# EAGLE design 2022国技館コントローラ (EAGLE 9.6.2)
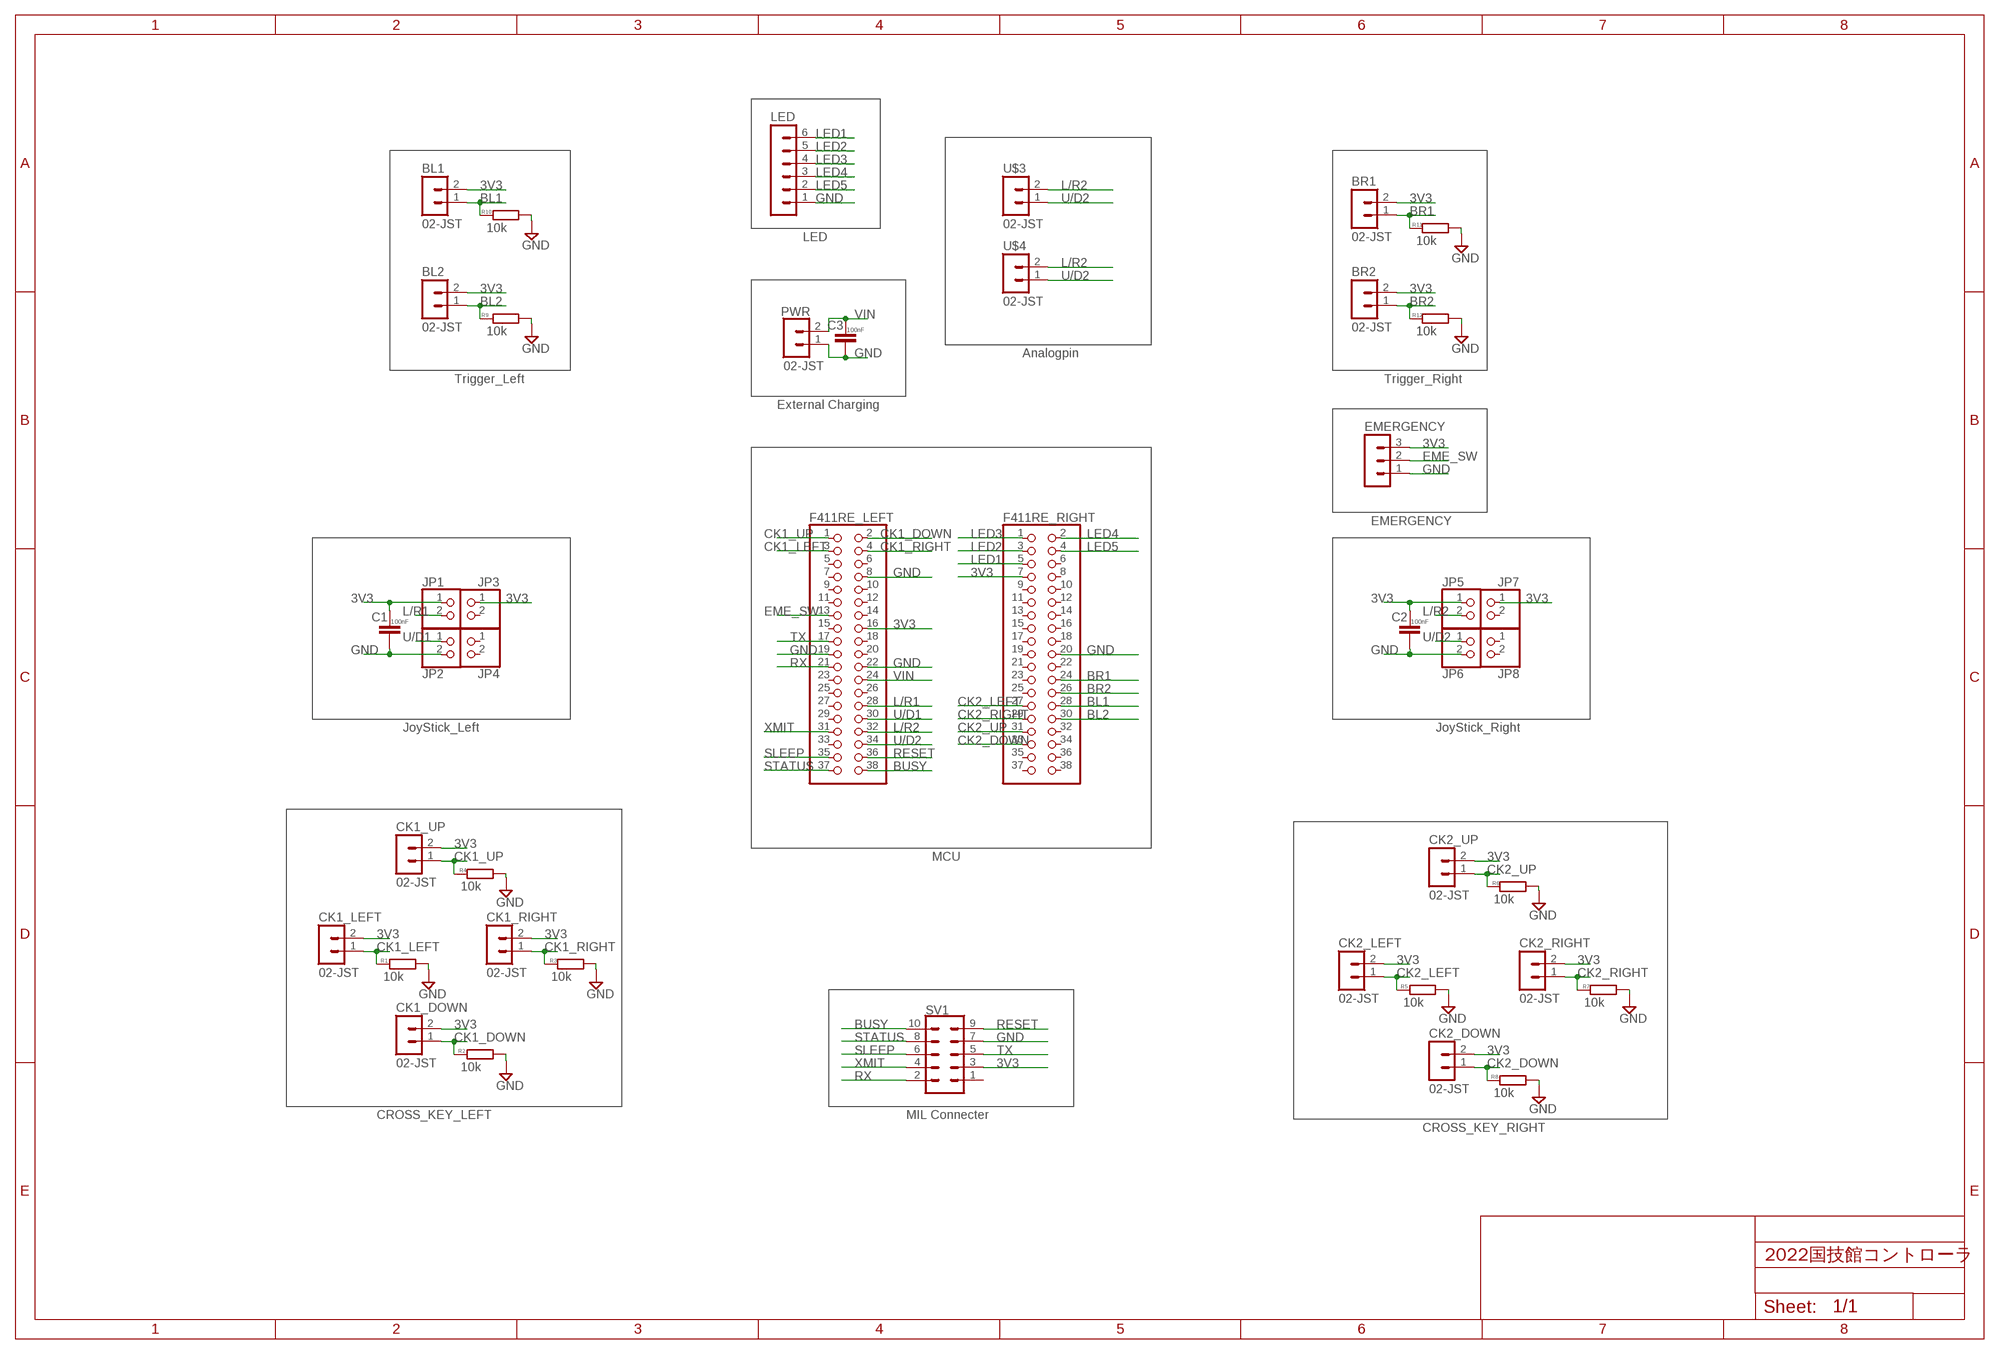
[diagram p0: schematic, sheet 1]

## Parts
BL1  02-JST  [B2B-XH]
BL2  02-JST  [B2B-XH]
BR1  02-JST  [B2B-XH]
BR2  02-JST  [B2B-XH]
C1  100nF  C-EU025-024X044  [C025-024X044]
C2  100nF  C-EU025-024X044  [C025-024X044]
C3  100nF  C-EU025-024X044  [C025-024X044]
CK1_DOWN  02-JST  [B2B-XH]
CK1_LEFT  02-JST  [B2B-XH]
CK1_RIGHT  02-JST  [B2B-XH]
CK1_UP  02-JST  [B2B-XH]
CK2_DOWN  02-JST  [B2B-XH]
CK2_LEFT  02-JST  [B2B-XH]
CK2_RIGHT  02-JST  [B2B-XH]
CK2_UP  02-JST  [B2B-XH]
EMERGENCY  03-JST  [B3B-XH]
F411RE_LEFT  PINHD-2X19  [2X19]
F411RE_RIGHT  PINHD-2X19  [2X19]
JP1  PINHD-1X2  [1X02]
JP2  PINHD-1X2  [1X02]
JP3  PINHD-1X2  [1X02]
JP4  PINHD-1X2  [1X02]
JP5  PINHD-1X2  [1X02]
JP6  PINHD-1X2  [1X02]
JP7  PINHD-1X2  [1X02]
JP8  PINHD-1X2  [1X02]
LED  06-JST  [B6B-XH]
PWR  02-JST  [B2B-XH]
R1  10k  R-EU_0204/7  [0204/7]
R2  10k  R-EU_0204/7  [0204/7]
R3  10k  R-EU_0204/7  [0204/7]
R4  10k  R-EU_0204/7  [0204/7]
R5  10k  R-EU_0204/7  [0204/7]
R6  10k  R-EU_0204/7  [0204/7]
R7  10k  R-EU_0204/7  [0204/7]
R8  10k  R-EU_0204/7  [0204/7]
R9  10k  R-EU_0204/7  [0204/7]
R10  10k  R-EU_0204/7  [0204/7]
R11  10k  R-EU_0204/7  [0204/7]
R12  10k  R-EU_0204/7  [0204/7]
SV1  ML10  [ML10]
U$3  02-JST  [B2B-XH]
U$4  02-JST  [B2B-XH]

## Nets
3V3: BL1.2 BL2.2 BR1.2 BR2.2 C1.1 C2.1 CK1_DOWN.2 CK1_LEFT.2 CK1_RIGHT.2 CK1_UP.2 CK2_DOWN.2 CK2_LEFT.2 CK2_RIGHT.2 CK2_UP.2 EMERGENCY.3 F411RE_LEFT.16 F411RE_RIGHT.7 JP1.1 JP3.1 JP5.1 JP7.1 SV1.3
BL1: BL1.1 F411RE_RIGHT.28 R10.1
BL2: BL2.1 F411RE_RIGHT.30 R9.1
BR1: BR1.1 F411RE_RIGHT.24 R11.1
BR2: BR2.1 F411RE_RIGHT.26 R12.1
BUSY: F411RE_LEFT.38 SV1.10
CK1_DOWN: CK1_DOWN.1 F411RE_LEFT.2 R2.1
CK1_LEFT: CK1_LEFT.1 F411RE_LEFT.3 R1.1
CK1_RIGHT: CK1_RIGHT.1 F411RE_LEFT.4 R3.1
CK1_UP: CK1_UP.1 F411RE_LEFT.1 R4.1
CK2_DOWN: CK2_DOWN.1 F411RE_RIGHT.33 R8.1
CK2_LEFT: CK2_LEFT.1 F411RE_RIGHT.27 R5.1
CK2_RIGHT: CK2_RIGHT.1 F411RE_RIGHT.29 R7.1
CK2_UP: CK2_UP.1 F411RE_RIGHT.31 R6.1
EME_SW: EMERGENCY.2 F411RE_LEFT.13
GND: C1.2 C2.2 C3.2 EMERGENCY.1 F411RE_LEFT.8 F411RE_LEFT.19 F411RE_LEFT.22 F411RE_RIGHT.20 JP2.2 JP6.2 LED.1 PWR.1 R1.2 R2.2 R3.2 R4.2 R5.2 R6.2 R7.2 R8.2 R9.2 R10.2 R11.2 R12.2 SV1.7
L/R1: F411RE_LEFT.28 JP1.2
L/R2: F411RE_LEFT.32 JP5.2 U$3.2 U$4.2
LED1: F411RE_RIGHT.5 LED.6
LED2: F411RE_RIGHT.3 LED.5
LED3: F411RE_RIGHT.1 LED.4
LED4: F411RE_RIGHT.2 LED.3
LED5: F411RE_RIGHT.4 LED.2
RESET: F411RE_LEFT.36 SV1.9
RX: F411RE_LEFT.21 SV1.2
SLEEP: F411RE_LEFT.35 SV1.6
STATUS: F411RE_LEFT.37 SV1.8
TX: F411RE_LEFT.17 SV1.5
U/D1: F411RE_LEFT.30 JP2.1
U/D2: F411RE_LEFT.34 JP6.1 U$3.1 U$4.1
VIN: C3.1 F411RE_LEFT.24 PWR.2
XMIT: F411RE_LEFT.31 SV1.4
Unconnected: F411RE_LEFT.5 F411RE_LEFT.6 F411RE_LEFT.7 F411RE_LEFT.9 F411RE_LEFT.10 F411RE_LEFT.11 F411RE_LEFT.12 F411RE_LEFT.14 F411RE_LEFT.15 F411RE_LEFT.18 F411RE_LEFT.20 F411RE_LEFT.23 F411RE_LEFT.25 F411RE_LEFT.26 F411RE_LEFT.27 F411RE_LEFT.29 F411RE_LEFT.33 F411RE_RIGHT.6 F411RE_RIGHT.8 F411RE_RIGHT.9 F411RE_RIGHT.10 F411RE_RIGHT.11 F411RE_RIGHT.12 F411RE_RIGHT.13 F411RE_RIGHT.14 F411RE_RIGHT.15 F411RE_RIGHT.16 F411RE_RIGHT.17 F411RE_RIGHT.18 F411RE_RIGHT.19 F411RE_RIGHT.21 F411RE_RIGHT.22 F411RE_RIGHT.23 F411RE_RIGHT.25 F411RE_RIGHT.32 F411RE_RIGHT.34 F411RE_RIGHT.35 F411RE_RIGHT.36 F411RE_RIGHT.37 F411RE_RIGHT.38 JP3.2 JP4.1 JP4.2 JP7.2 JP8.1 JP8.2 SV1.1

## Notes on the sheet
- LED
- Analogpin
- Trigger_Left | Trigger_Right
- External Charging
- EMERGENCY
- JoyStick_Left | JoyStick_Right
- MCU
- CROSS_KEY_LEFT | MIL Connecter
- CROSS_KEY_RIGHT

## Library data of the parts
BL1 BL2 BR1 BR2 CK1_DOWN CK1_LEFT CK1_RIGHT CK1_UP CK2_DOWN CK2_LEFT CK2_RIGHT CK2_UP = con-jst-xh:02-JST: JST CONNECTOR
C1-C3 = rcl:C-EU: CAPACITOR, European symbol; SPICEPREFIX: C
EMERGENCY = con-jst-xh:03-JST: JST CONNECTOR
F411RE_LEFT F411RE_RIGHT = pinhead:PINHD-2X19: PIN HEADER
JP1-JP8 = pinhead:PINHD-1X2: PIN HEADER
LED = con-jst-xh:06-JST: JST CONNECTOR
PWR U$3 U$4 = con-jst-xh (1):02-JST: JST CONNECTOR
R1-R12 = rcl:R-EU_: RESISTOR, European symbol; SPICEPREFIX: R
SV1 = con-ml:ML10: HARTING; OC_FARNELL: unknown; OC_NEWARK: unknown

## Board
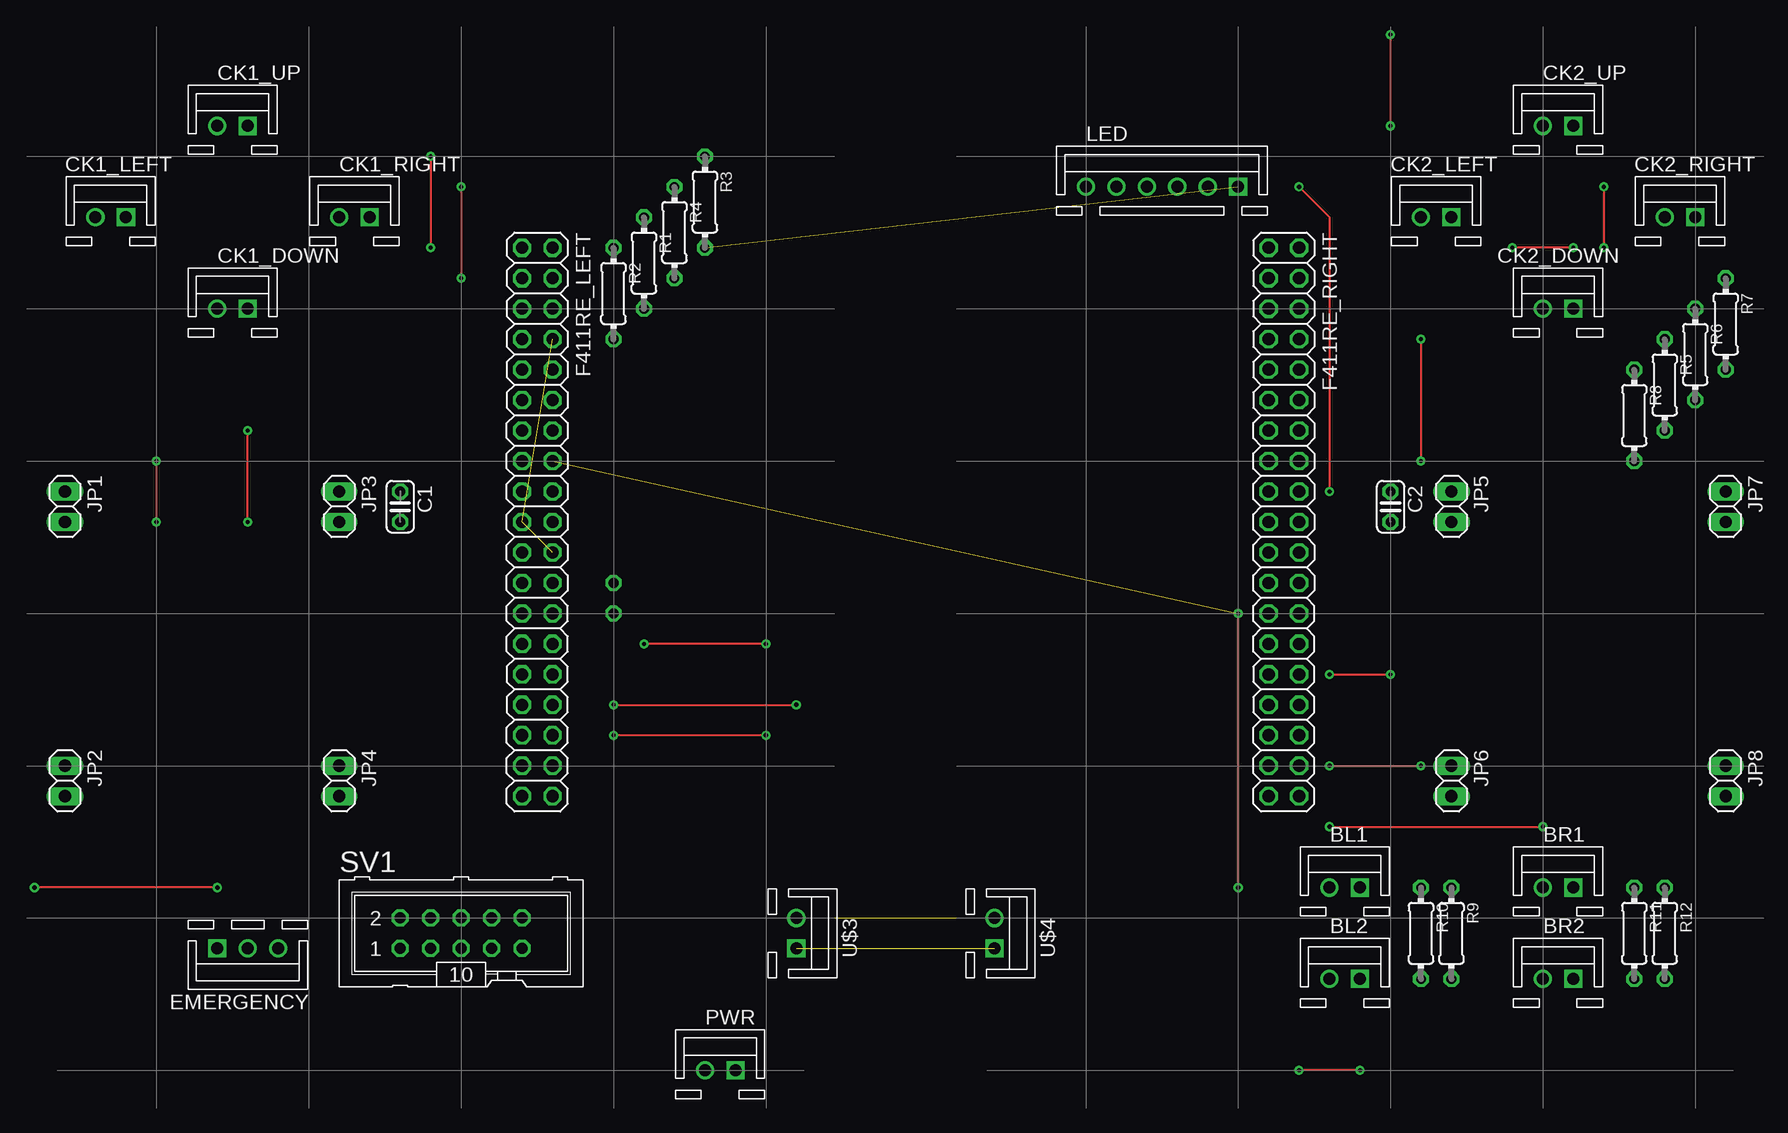
[diagram p1: board, top side]
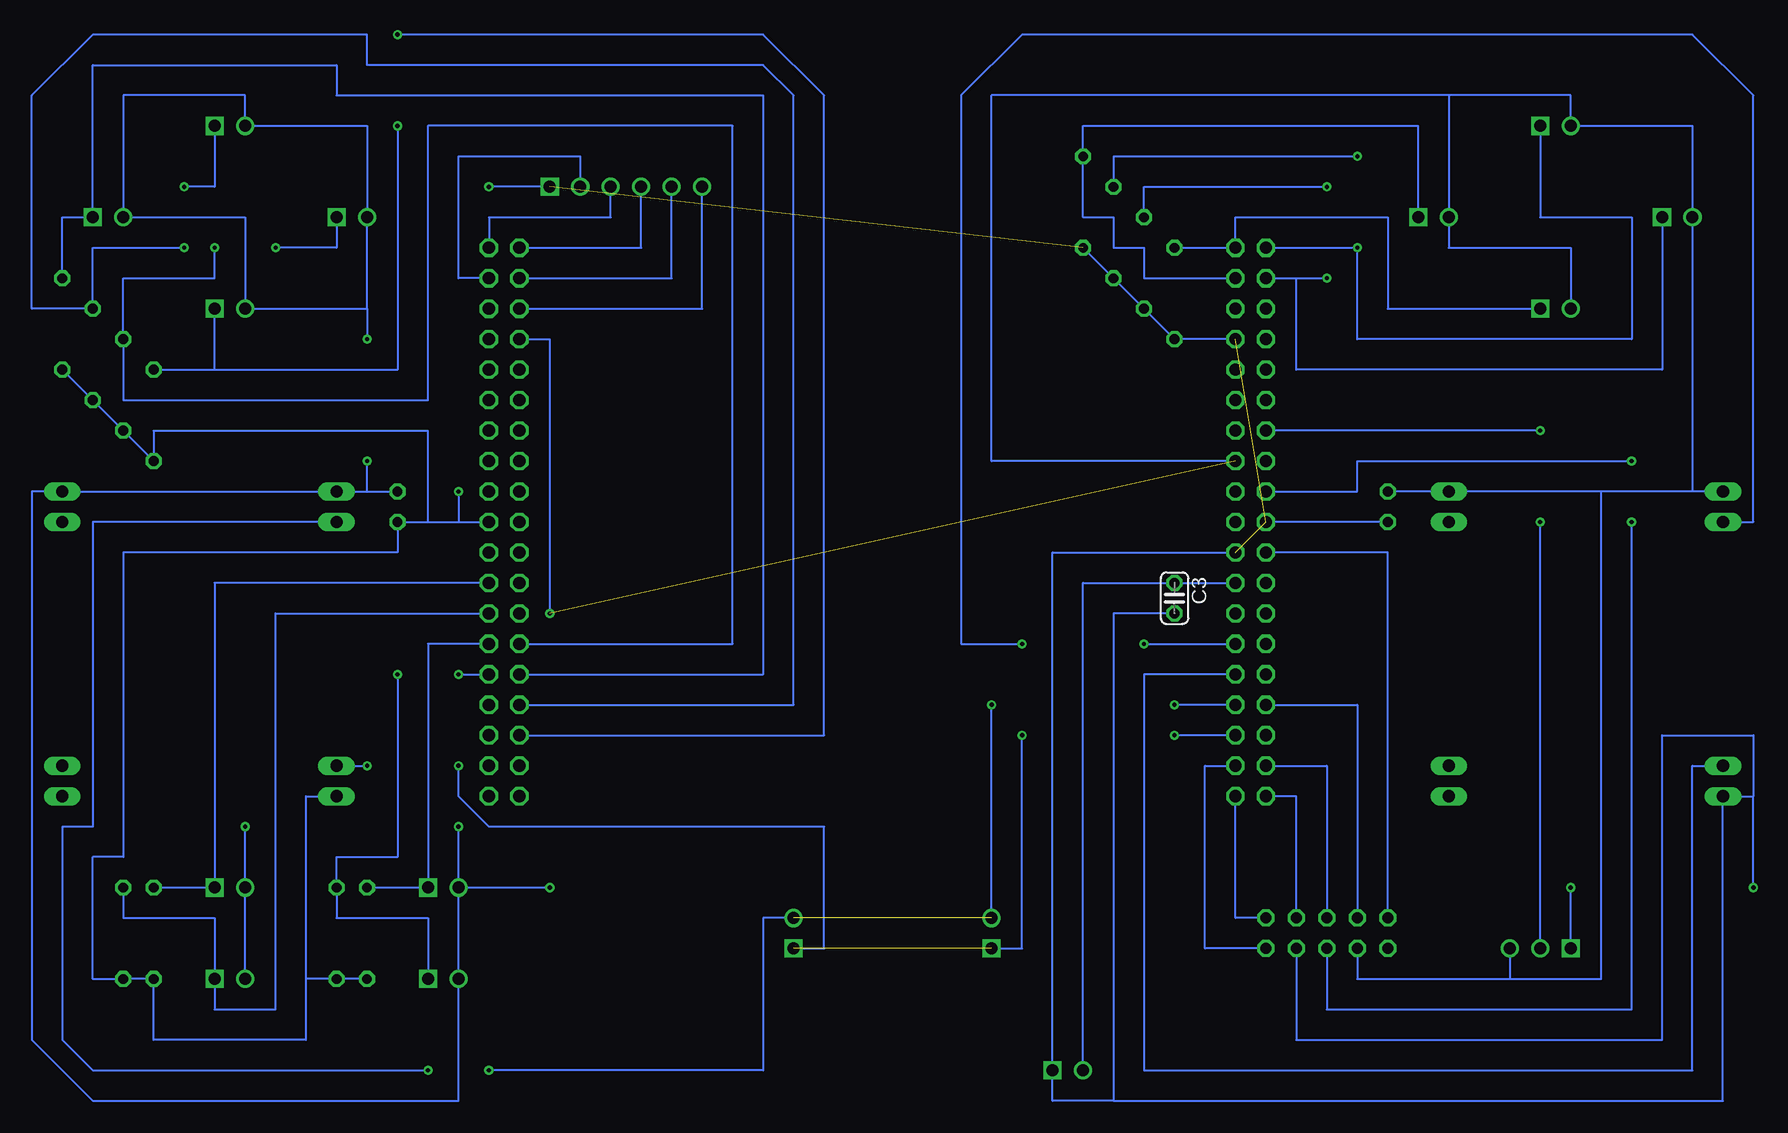
[diagram p2: board, bottom side, seen from below]

No outline drawn. Coordinates in mm, seen from the top.
Copper layers (1*16): Top 0.035mm / dielectric 1.5mm / Bottom 0.035mm
Design rules "default": minimum track width 6mil, minimum drill 0.35mm, track to track 6mil, track to pad 6mil, pad to pad 6mil, via to via 6mil, smd to smd 6mil, copper to edge 40mil, drill to drill 6mil, minimum pad ring 10mil, minimum via ring 8mil, stop-mask expansion 4mil, vias tented up to drill 0mil, thermal gap 10mil

### Footprints (pad centres in the part's own frame; a part is rotated, then mirrored left to right if it is on the bottom)
B2B-XH = drill 1 square: 1 1.27,0 | drill 1: 2 -1.27,0
C025-024X044 = drill 0.813 octagon: 1 -1.27,0; 2 1.27,0
B3B-XH = drill 1 square: 1 2.54,0 | drill 1: 2 0,0; 3 -2.54,0
2X19 = drill 1.016 octagon: 1 -22.86,-1.27; 2 -22.86,1.27; 3 -20.32,-1.27; 4 -20.32,1.27; 5 -17.78,-1.27; 6 -17.78,1.27; 7 -15.24,-1.27; 8 -15.24,1.27; 9 -12.7,-1.27; 10 -12.7,1.27; 11 -10.16,-1.27; 12 -10.16,1.27; 13 -7.62,-1.27; 14 -7.62,1.27; 15 -5.08,-1.27; 16 -5.08,1.27; 17 -2.54,-1.27; 18 -2.54,1.27; 19 0,-1.27; 20 0,1.27; 21 2.54,-1.27; 22 2.54,1.27; 23 5.08,-1.27; 24 5.08,1.27; 25 7.62,-1.27; 26 7.62,1.27; 27 10.16,-1.27; 28 10.16,1.27; 29 12.7,-1.27; 30 12.7,1.27; 31 15.24,-1.27; 32 15.24,1.27; 33 17.78,-1.27; 34 17.78,1.27; 35 20.32,-1.27; 36 20.32,1.27; 37 22.86,-1.27; 38 22.86,1.27
1X02 = drill 1.016 long: 1 -1.27,0; 2 1.27,0
B6B-XH = drill 1 square: 1 6.35,0 | drill 1: 2 3.81,0; 3 1.27,0; 4 -1.27,0; 5 -3.81,0; 6 -6.35,0
0204/7 = drill 0.813 octagon: 1 -3.81,0; 2 3.81,0
ML10 = drill 0.914 octagon: 1 -5.08,-1.27; 2 -5.08,1.27; 3 -2.54,-1.27; 4 -2.54,1.27; 5 0,-1.27; 6 0,1.27; 7 2.54,-1.27; 8 2.54,1.27; 9 5.08,-1.27; 10 5.08,1.27

### Placement (x,y rotation side)
BL1  102.87,20.32 0 top
BL2  102.87,12.7 0 top
BR1  120.65,20.32 0 top
BR2  120.65,12.7 0 top
C1  24.13,52.07 270 top
C2  106.68,52.07 270 top
C3  41.91,44.45 270 bottom
CK1_DOWN  10.16,68.58 0 top
CK1_LEFT  0,76.2 0 top
CK1_RIGHT  20.32,76.2 0 top
CK1_UP  10.16,83.82 0 top
CK2_DOWN  120.65,68.58 0 top
CK2_LEFT  110.49,76.2 0 top
CK2_RIGHT  130.81,76.2 0 top
CK2_UP  120.65,83.82 0 top
EMERGENCY  11.43,15.24 180 top
F411RE_LEFT  35.56,50.8 270 top
F411RE_RIGHT  97.79,50.8 270 top
JP1  -3.81,52.07 270 top
JP2  -3.81,29.21 270 top
JP3  19.05,52.07 270 top
JP4  19.05,29.21 270 top
JP5  111.76,52.07 270 top
JP6  111.76,29.21 270 top
JP7  134.62,52.07 270 top
JP8  134.62,29.21 270 top
LED  87.63,78.74 0 top
PWR  50.8,5.08 0 top
R1  44.45,72.39 270 top
R2  41.91,69.85 270 top
R3  49.53,77.47 270 top
R4  46.99,74.93 270 top
R5  129.54,62.23 270 top
R6  132.08,64.77 270 top
R7  134.62,67.31 270 top
R8  127,59.69 270 top
R9  111.76,16.51 270 top
R10  109.22,16.51 270 top
R11  127,16.51 270 top
R12  129.54,16.51 270 top
SV1  29.21,16.51 0 top
U$1  [TYPE.B]  -8.89,93.98 270 top
U$2  [TYPE.B]  68.58,93.98 270 top
U$3  57.15,16.51 270 top
U$4  73.66,16.51 270 top

### Tracks (layer width: path | path; a pad name or v marks a point on that pad's centre or on a via)
3V3  (via drill 0.35)  (1 unrouted)
  Top 0.152: v101.6,25.4 v119.38,25.4 | v109.22,66.04 v109.22,55.88 | v93.98,43.18 v93.98,20.32
  Bottom 0.152: 109.22,53.34 JP5.1 JP7.1 137.16,53.34 137.16,7.62 132.08,2.54 101.6,2.54 BL2.2 BL1.2 | 109.22,53.34 C2.1 | BR2.2 BR1.2 v119.38,25.4 | JP1.1 -1.27,53.34 | -1.27,53.34 6.35,53.34 | 6.35,53.34 JP3.1 C1.1 | 19.05,86.36 8.89,86.36 CK1_UP.2 -1.27,83.82 CK1_LEFT.2 -1.27,53.34 | 19.05,86.36 CK1_RIGHT.2 19.05,73.66 8.89,73.66 CK1_DOWN.2 | 109.22,68.58 CK2_DOWN.2 119.38,76.2 CK2_RIGHT.2 129.54,86.36 119.38,86.36 CK2_UP.2 109.22,83.82 CK2_LEFT.2 109.22,68.58 | F411RE_LEFT.16 57.15,55.88 57.15,86.36 19.05,86.36 | SV1.3 26.67,12.7 13.97,12.7 | 13.97,12.7 6.35,12.7 6.35,53.34 | BL1.2 v101.6,25.4 | F411RE_RIGHT.7 93.98,66.04 v93.98,43.18 | 109.22,68.58 v109.22,66.04 | 109.22,53.34 v109.22,55.88 | BL1.2 v93.98,20.32 | EMERGENCY.3 13.97,12.7
BL1
  Bottom 0.152: R10.1 BL1.1 104.14,40.64 F411RE_RIGHT.28
BL2  (via drill 0.35)
  Top 0.152: v101.6,38.1 v106.68,38.1
  Bottom 0.152: BL2.1 104.14,17.78 111.76,17.78 R9.1 111.76,22.86 106.68,22.86 v106.68,38.1 | v101.6,38.1 F411RE_RIGHT.30
BR1
  Bottom 0.152: R11.1 BR1.1 121.92,45.72 F411RE_RIGHT.24
BR2
  Bottom 0.152: R12.1 129.54,17.78 121.92,17.78 BR2.1 121.92,10.16 116.84,10.16 116.84,43.18 F411RE_RIGHT.26
BUSY
  Bottom 0.152: SV1.10 36.83,17.78 F411RE_LEFT.38
CK1_DOWN
  Bottom 0.152: CK1_DOWN.1 24.13,68.58 24.13,76.2 36.83,76.2 F411RE_LEFT.2 R2.1
CK1_LEFT  (via drill 0.35)
  Top 0.152: v29.21,78.74 v29.21,71.12
  Bottom 0.152: 31.75,71.12 31.75,63.5 1.27,63.5 CK1_LEFT.1 | F411RE_LEFT.3 31.75,71.12 | 31.75,71.12 v29.21,71.12 | R1.1 44.45,78.74 v29.21,78.74
CK1_RIGHT
  Bottom 0.152: CK1_RIGHT.1 21.59,83.82 49.53,83.82 R3.1 49.53,76.2 46.99,76.2 46.99,73.66 44.45,73.66 44.45,71.12 F411RE_LEFT.4
CK1_UP  (via drill 0.35)
  Top 0.152: v26.67,81.28 v26.67,73.66
  Bottom 0.152: CK1_UP.1 11.43,76.2 3.81,76.2 3.81,66.04 26.67,66.04 v26.67,73.66 F411RE_LEFT.1 | R4.1 46.99,81.28 v26.67,81.28
CK2_DOWN  (via drill 0.35)
  Top 0.152: v106.68,91.44 v106.68,83.82
  Bottom 0.152: F411RE_RIGHT.33 71.12,33.02 71.12,86.36 76.2,91.44 v106.68,91.44 | 121.92,63.5 CK2_DOWN.1 | 121.92,63.5 106.68,63.5 v106.68,83.82 | R8.1 121.92,63.5
CK2_LEFT  (via drill 0.35)
  Top 0.152: v121.92,73.66 v116.84,73.66
  Bottom 0.152: F411RE_RIGHT.27 78.74,40.64 78.74,83.82 104.14,83.82 104.14,60.96 129.54,60.96 R5.1 129.54,71.12 121.92,71.12 v121.92,73.66 | CK2_LEFT.1 111.76,73.66 v116.84,73.66
CK2_RIGHT
  Bottom 0.152: F411RE_RIGHT.29 76.2,38.1 76.2,86.36 111.76,86.36 111.76,88.9 132.08,88.9 CK2_RIGHT.1 134.62,76.2 R7.1
CK2_UP  (via drill 0.35)
  Top 0.152: v124.46,78.74 v124.46,73.66
  Bottom 0.152: F411RE_RIGHT.31 73.66,35.56 73.66,86.36 76.2,88.9 109.22,88.9 109.22,91.44 132.08,91.44 137.16,86.36 137.16,68.58 R6.1 132.08,73.66 v124.46,73.66 | CK2_UP.1 121.92,78.74 v124.46,78.74
EME_SW  (via drill 0.35)
  Top 0.152: v11.43,50.8 v11.43,58.42
  Bottom 0.152: EMERGENCY.2 v11.43,50.8 | v11.43,58.42 F411RE_LEFT.13
GND  (via drill 0.35)  (3 unrouted)
  Top 0.152: v99.06,78.74 101.6,76.2 v101.6,53.34 | v8.89,20.32 v-6.35,20.32
  Bottom 0.152: C3.2 46.99,43.18 46.99,2.54 | 46.99,2.54 52.07,2.54 PWR.1 52.07,48.26 F411RE_LEFT.22 | 46.99,2.54 -3.81,2.54 JP2.2 -6.35,27.94 | -6.35,27.94 -6.35,33.02 1.27,33.02 1.27,7.62 31.75,7.62 SV1.7 | C1.2 F411RE_LEFT.19 | F411RE_LEFT.8 R2.2 R1.2 R4.2 R3.2 | 104.14,50.8 C2.2 106.68,48.26 129.54,48.26 129.54,22.86 132.08,22.86 132.08,12.7 R12.2 R11.2 127,7.62 114.3,7.62 114.3,12.7 | 104.14,50.8 101.6,50.8 | 101.6,50.8 F411RE_RIGHT.20 | R10.2 R9.2 114.3,12.7 | 114.3,12.7 114.3,27.94 JP6.2 | R7.2 R6.2 R5.2 R8.2 127,58.42 104.14,58.42 104.14,50.8 | LED.1 v99.06,78.74 | v101.6,53.34 101.6,50.8 | EMERGENCY.1 v8.89,20.32 | v-6.35,20.32 -6.35,27.94
L/R1  (via drill 0.35)
  Top 0.152: v54.61,40.64 v44.45,40.64
  Bottom 0.152: JP1.2 -6.35,50.8 -6.35,86.36 -1.27,91.44 54.61,91.44 59.69,86.36 59.69,40.64 v54.61,40.64 | v44.45,40.64 F411RE_LEFT.28
L/R2  (via drill 0.35)  (1 unrouted)
  Top 0.152: v41.91,35.56 v57.15,35.56 | v104.14,5.08 v99.06,5.08
  Bottom 0.152: F411RE_LEFT.32 v41.91,35.56 | U$3.2 v57.15,35.56 | JP5.2 132.08,50.8 132.08,25.4 134.62,25.4 134.62,7.62 132.08,5.08 v104.14,5.08 | U$4.2 76.2,17.78 76.2,5.08 v99.06,5.08
LED1
  Bottom 0.152: F411RE_RIGHT.5 81.28,68.58 LED.6
LED2
  Bottom 0.152: F411RE_RIGHT.3 83.82,71.12 LED.5
LED3
  Bottom 0.152: F411RE_RIGHT.1 86.36,73.66 LED.4
LED4
  Bottom 0.152: F411RE_RIGHT.2 99.06,76.2 88.9,76.2 LED.3
LED5
  Bottom 0.152: F411RE_RIGHT.4 101.6,71.12 101.6,81.28 91.44,81.28 LED.2
RESET
  Bottom 0.152: SV1.9 39.37,15.24 39.37,30.48 F411RE_LEFT.36
RX
  Bottom 0.152: SV1.2 24.13,48.26 F411RE_LEFT.21
SLEEP
  Bottom 0.152: F411RE_LEFT.35 29.21,30.48 SV1.6
STATUS
  Bottom 0.152: F411RE_LEFT.37 31.75,27.94 SV1.8
TX  (via drill 0.35)
  Top 0.152: v3.81,55.88 v3.81,50.8
  Bottom 0.152: F411RE_LEFT.17 26.67,53.34 26.67,55.88 v3.81,55.88 | SV1.5 29.21,10.16 3.81,10.16 v3.81,50.8
U/D1
  Bottom 0.152: F411RE_LEFT.30 44.45,38.1 44.45,5.08 -1.27,5.08 -1.27,30.48 JP2.1
U/D2  (via drill 0.35)  (1 unrouted)
  Top 0.152: v54.61,33.02 v41.91,33.02 | v101.6,30.48 v109.22,30.48
  Bottom 0.152: F411RE_LEFT.34 v41.91,33.02 | U$3.1 54.61,15.24 v54.61,33.02 | U$4.1 71.12,15.24 71.12,25.4 99.06,25.4 101.6,27.94 v101.6,30.48 | JP6.1 v109.22,30.48
VIN
  Bottom 0.152: F411RE_LEFT.24 C3.1 49.53,45.72 PWR.2
XMIT
  Bottom 0.152: F411RE_LEFT.31 26.67,35.56 SV1.4